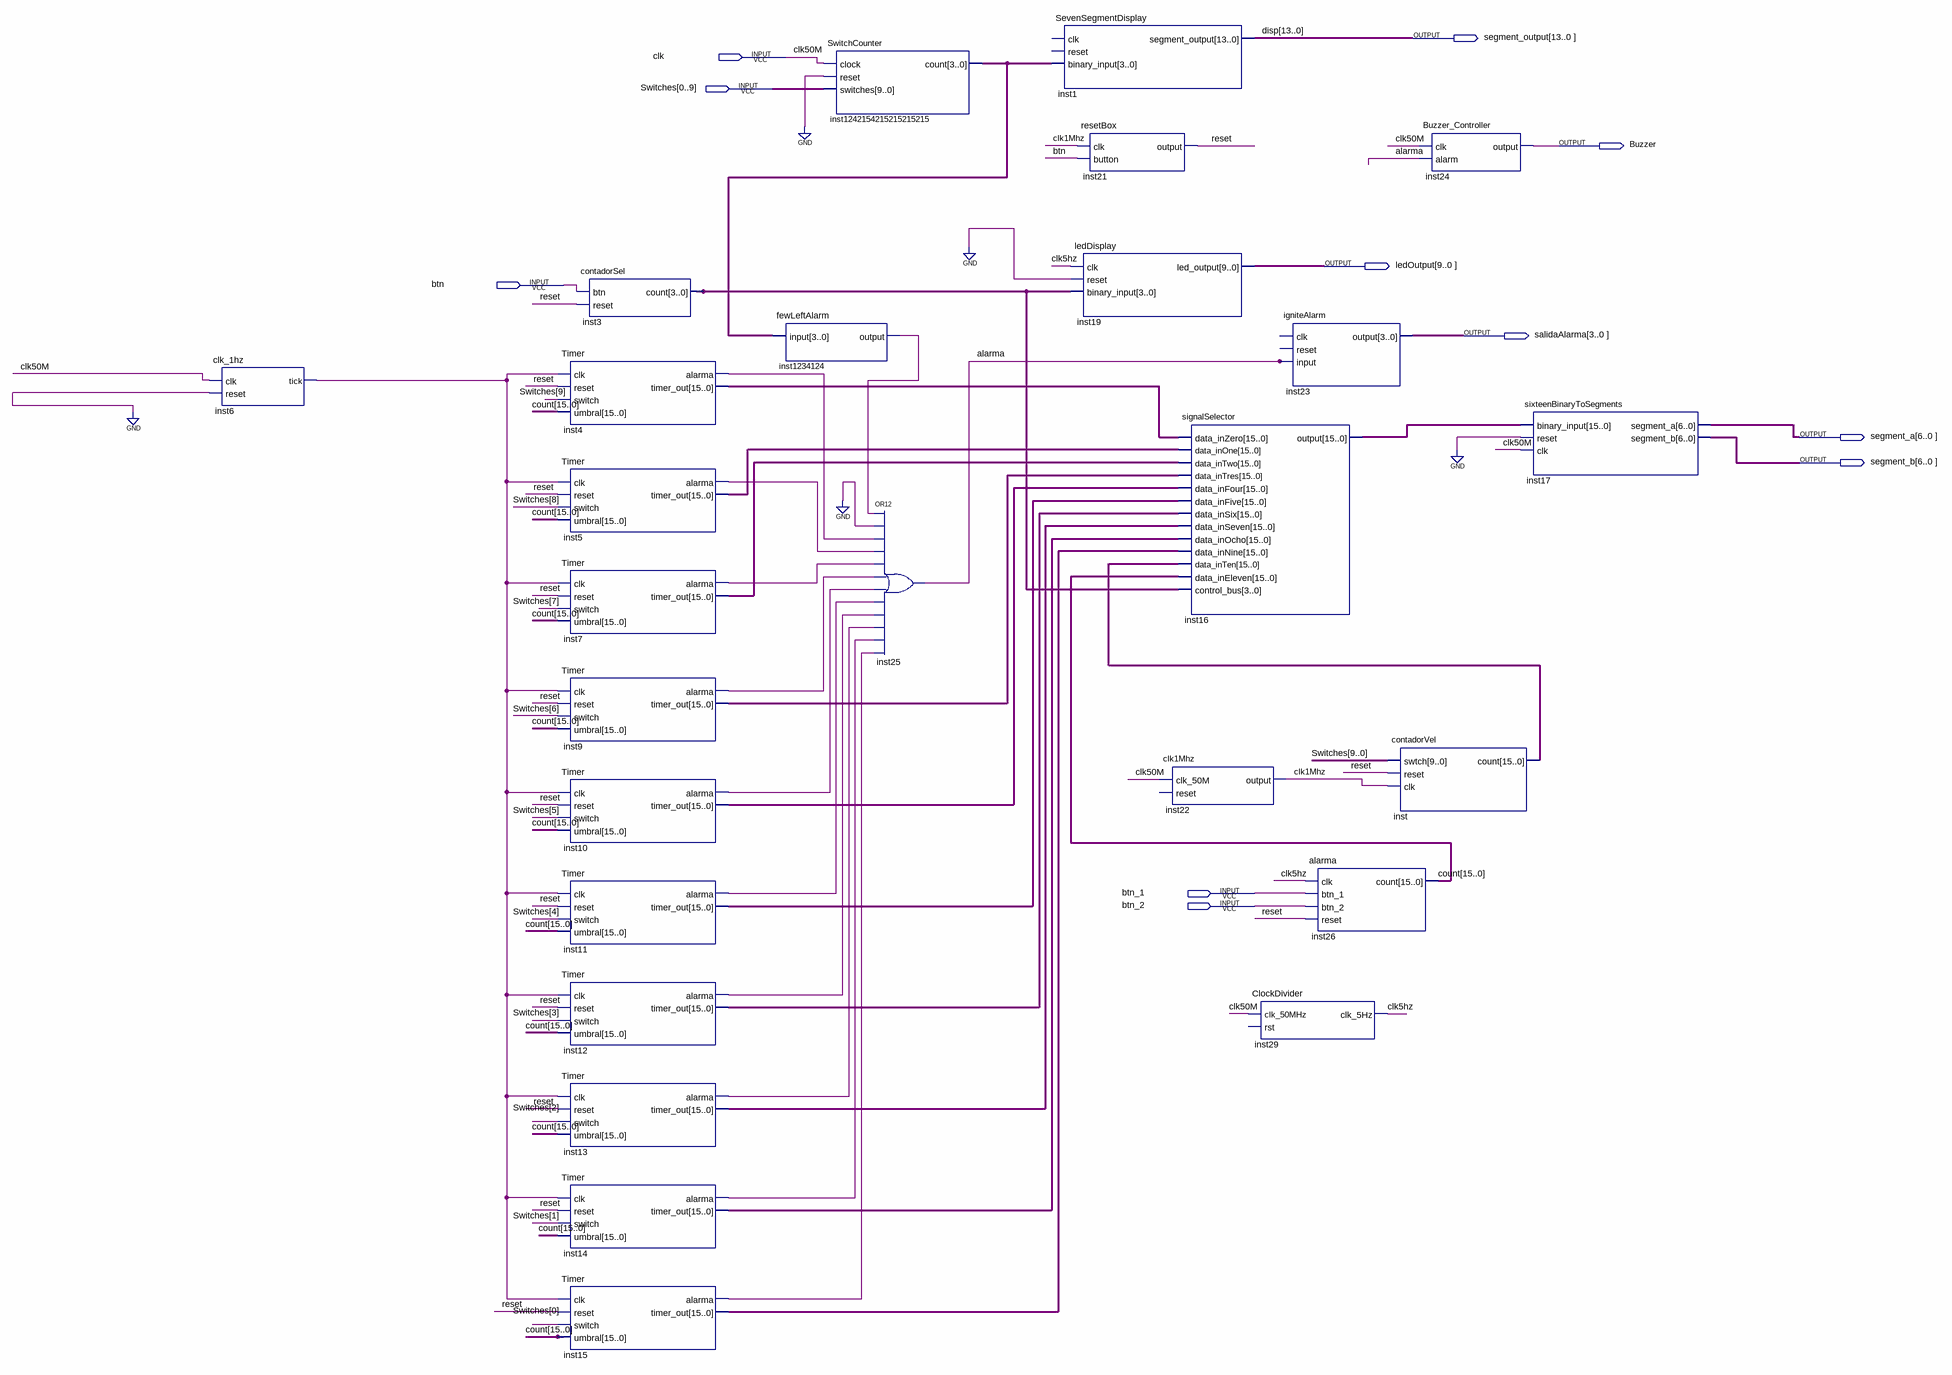
[diagram p0: schematic sheet]
// Quartus schematic Vhdl1.bdf as structural Verilog: 26 symbols, 11 pins
module Vhdl1 (
  input  clk,
  input  [0:9] Switches,
  input  btn,
  input  btn_1,
  input  btn_2,
  output [13:0] segment_output,
  output Buzzer,
  output [9:0] ledOutput,
  output [3:0] salidaAlarma,
  output [6:0] segment_a,
  output [6:0] segment_b
);

  wire alarma, clk1Mhz, clk5hz, inst4_alarma, inst5_alarma, inst6_tick, inst7_alarma, inst9_alarma,
       inst10_alarma, inst11_alarma, inst12_alarma, inst13_alarma, inst14_alarma, inst15_alarma,
       inst1234124_output, reset;
  wire [3:0] inst3_count, inst1242154215215215215_count;
  wire [15:0] count, inst4_timer_out, inst5_timer_out, inst7_timer_out, inst9_timer_out, inst10_timer_out,
       inst11_timer_out, inst12_timer_out, inst13_timer_out, inst14_timer_out, inst15_timer_out,
       inst16_output, inst_count;

  clk_1hz inst6 (.clk(clk), .reset(1'b0), .tick(inst6_tick));
  contadorSel inst3 (.btn(btn), .reset(reset), .count(inst3_count));
  Timer inst4 (
    .clk(inst6_tick), .reset(reset), .switch(Switches[9]), .umbral(count), .alarma(inst4_alarma),
    .timer_out(inst4_timer_out));
  Timer inst5 (
    .clk(inst6_tick), .reset(reset), .switch(Switches[8]), .umbral(count), .alarma(inst5_alarma),
    .timer_out(inst5_timer_out));
  Timer inst7 (
    .clk(inst6_tick), .reset(reset), .switch(Switches[7]), .umbral(count), .alarma(inst7_alarma),
    .timer_out(inst7_timer_out));
  Timer inst9 (
    .clk(inst6_tick), .reset(reset), .switch(Switches[6]), .umbral(count), .alarma(inst9_alarma),
    .timer_out(inst9_timer_out));
  Timer inst10 (
    .clk(inst6_tick), .reset(reset), .switch(Switches[5]), .umbral(count), .alarma(inst10_alarma),
    .timer_out(inst10_timer_out));
  Timer inst11 (
    .clk(inst6_tick), .reset(reset), .switch(Switches[4]), .umbral(count), .alarma(inst11_alarma),
    .timer_out(inst11_timer_out));
  Timer inst12 (
    .clk(inst6_tick), .reset(reset), .switch(Switches[3]), .umbral(count), .alarma(inst12_alarma),
    .timer_out(inst12_timer_out));
  Timer inst13 (
    .clk(inst6_tick), .reset(reset), .switch(Switches[2]), .umbral(count), .alarma(inst13_alarma),
    .timer_out(inst13_timer_out));
  Timer inst14 (
    .clk(inst6_tick), .reset(reset), .switch(Switches[1]), .umbral(count), .alarma(inst14_alarma),
    .timer_out(inst14_timer_out));
  Timer inst15 (
    .clk(inst6_tick), .reset(reset), .switch(Switches[0]), .umbral(count), .alarma(inst15_alarma),
    .timer_out(inst15_timer_out));
  fewLeftAlarm inst1234124 (.\input (inst1242154215215215215_count), .\output (inst1234124_output));
  SwitchCounter inst1242154215215215215 (
    .clock(clk), .reset(1'b0), .switches(Switches), .count(inst1242154215215215215_count));
  or inst25 (alarma, inst1234124_output, 1'b0, inst4_alarma, inst5_alarma, inst7_alarma, inst9_alarma, inst10_alarma, inst11_alarma, inst12_alarma, inst13_alarma, inst14_alarma, inst15_alarma);
  SevenSegmentDisplay inst1 (
    .binary_input(inst1242154215215215215_count), .segment_output(segment_output));  // open: clk, reset
  resetBox inst21 (.clk(clk1Mhz), .button(btn), .\output (reset));
  ledDisplay inst19 (.clk(clk5hz), .reset(1'b0), .binary_input(inst3_count), .led_output(ledOutput));
  signalSelector inst16 (
    .data_inZero(inst4_timer_out), .data_inOne(inst5_timer_out), .data_inTwo(inst7_timer_out),
    .data_inTres(inst9_timer_out), .data_inFour(inst10_timer_out), .data_inFive(inst11_timer_out),
    .data_inSix(inst12_timer_out), .data_inSeven(inst13_timer_out), .data_inOcho(inst14_timer_out),
    .data_inNine(inst15_timer_out), .data_inTen(inst_count), .data_inEleven(count),
    .control_bus(inst3_count), .\output (inst16_output));
  clk1Mhz inst22 (.clk_50M(clk), .\output (clk1Mhz));  // open: reset
  ClockDivider inst29 (.clk_50MHz(clk), .clk_5Hz(clk5hz));  // open: rst
  igniteAlarm inst23 (.\input (alarma), .\output (salidaAlarma));  // open: clk, reset
  alarma inst26 (.clk(clk5hz), .btn_1(btn_1), .btn_2(btn_2), .reset(reset), .count(count));
  contadorVel inst (
    .swtch({Switches[9], Switches[8], Switches[7], Switches[6], Switches[5], Switches[4], Switches[3], Switches[2], Switches[1], Switches[0]}),
    .reset(reset), .clk(clk1Mhz), .count(inst_count));
  Buzzer_Controller inst24 (.clk(clk), .alarm(alarma), .\output (Buzzer));
  sixteenBinaryToSegments inst17 (
    .binary_input(inst16_output), .reset(1'b0), .clk(clk), .segment_a(segment_a), .segment_b(segment_b));

  // Other names for the same wires on the sheet: clk50M = clk; disp[13:0] = segment_output
endmodule
